# Altium schematic sheet FPGA.SCHDOC: FPGA Connections
size A2; Organization: Altium Limited.; Address1: Level 3, 12a Rodborough Rd; Address2: Frenchs Forest 2086; Address3: NSW; Address4: AUSTRALIA; SheetNumber: 6; SheetTotal: 19; PageSetup: Record=PageOptions|CenterHorizontal=True|CenterVertical=True|PrintScale=0.71|XCorrection=1.00|YCorrection=1.00|PrintKind=0|BorderSize=5000000|LeftOffset=0|BottomOffset=0|Orientation=2|PaperLength=1000|PaperWidth=1000|Scale=100|PaperSource=7|PrintQuality=600|MediaType=1|DitherType=10|PaperKind=A3 (297 x 420mm)|PrintScaleMode=1
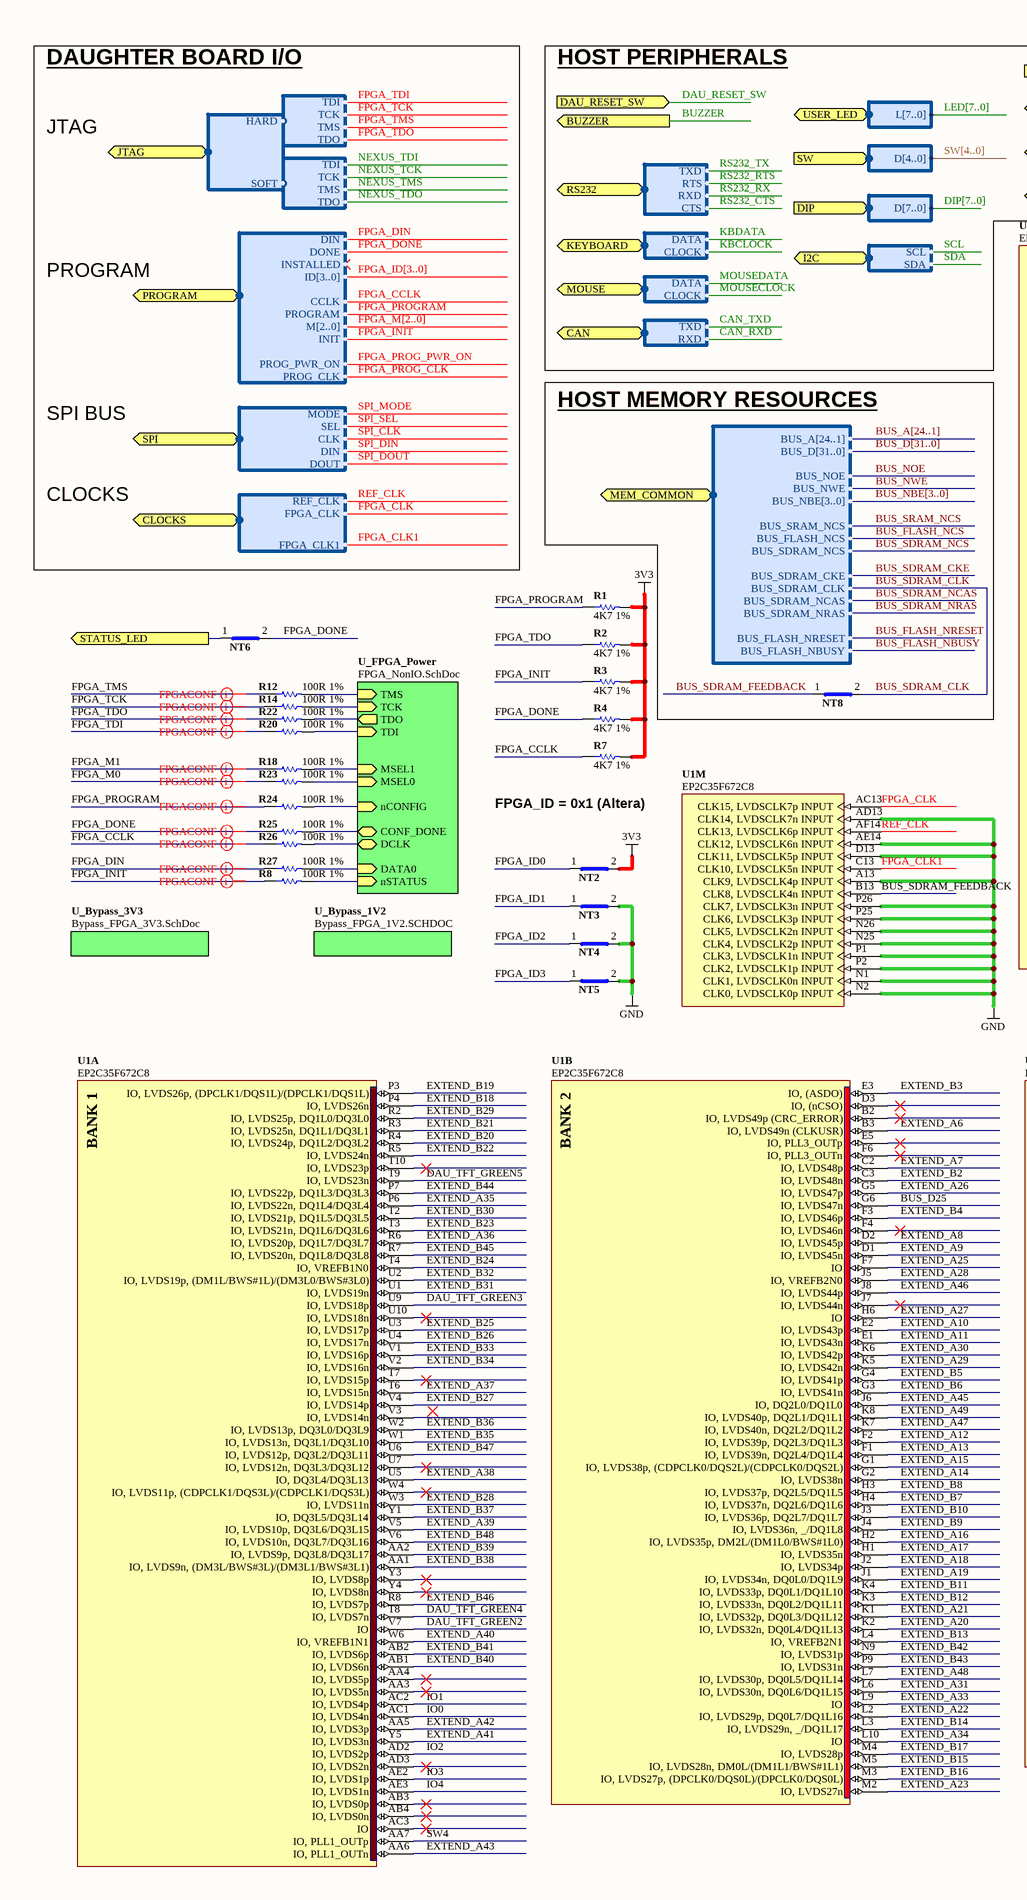
[diagram p0: FPGA.SCHDOC, left]
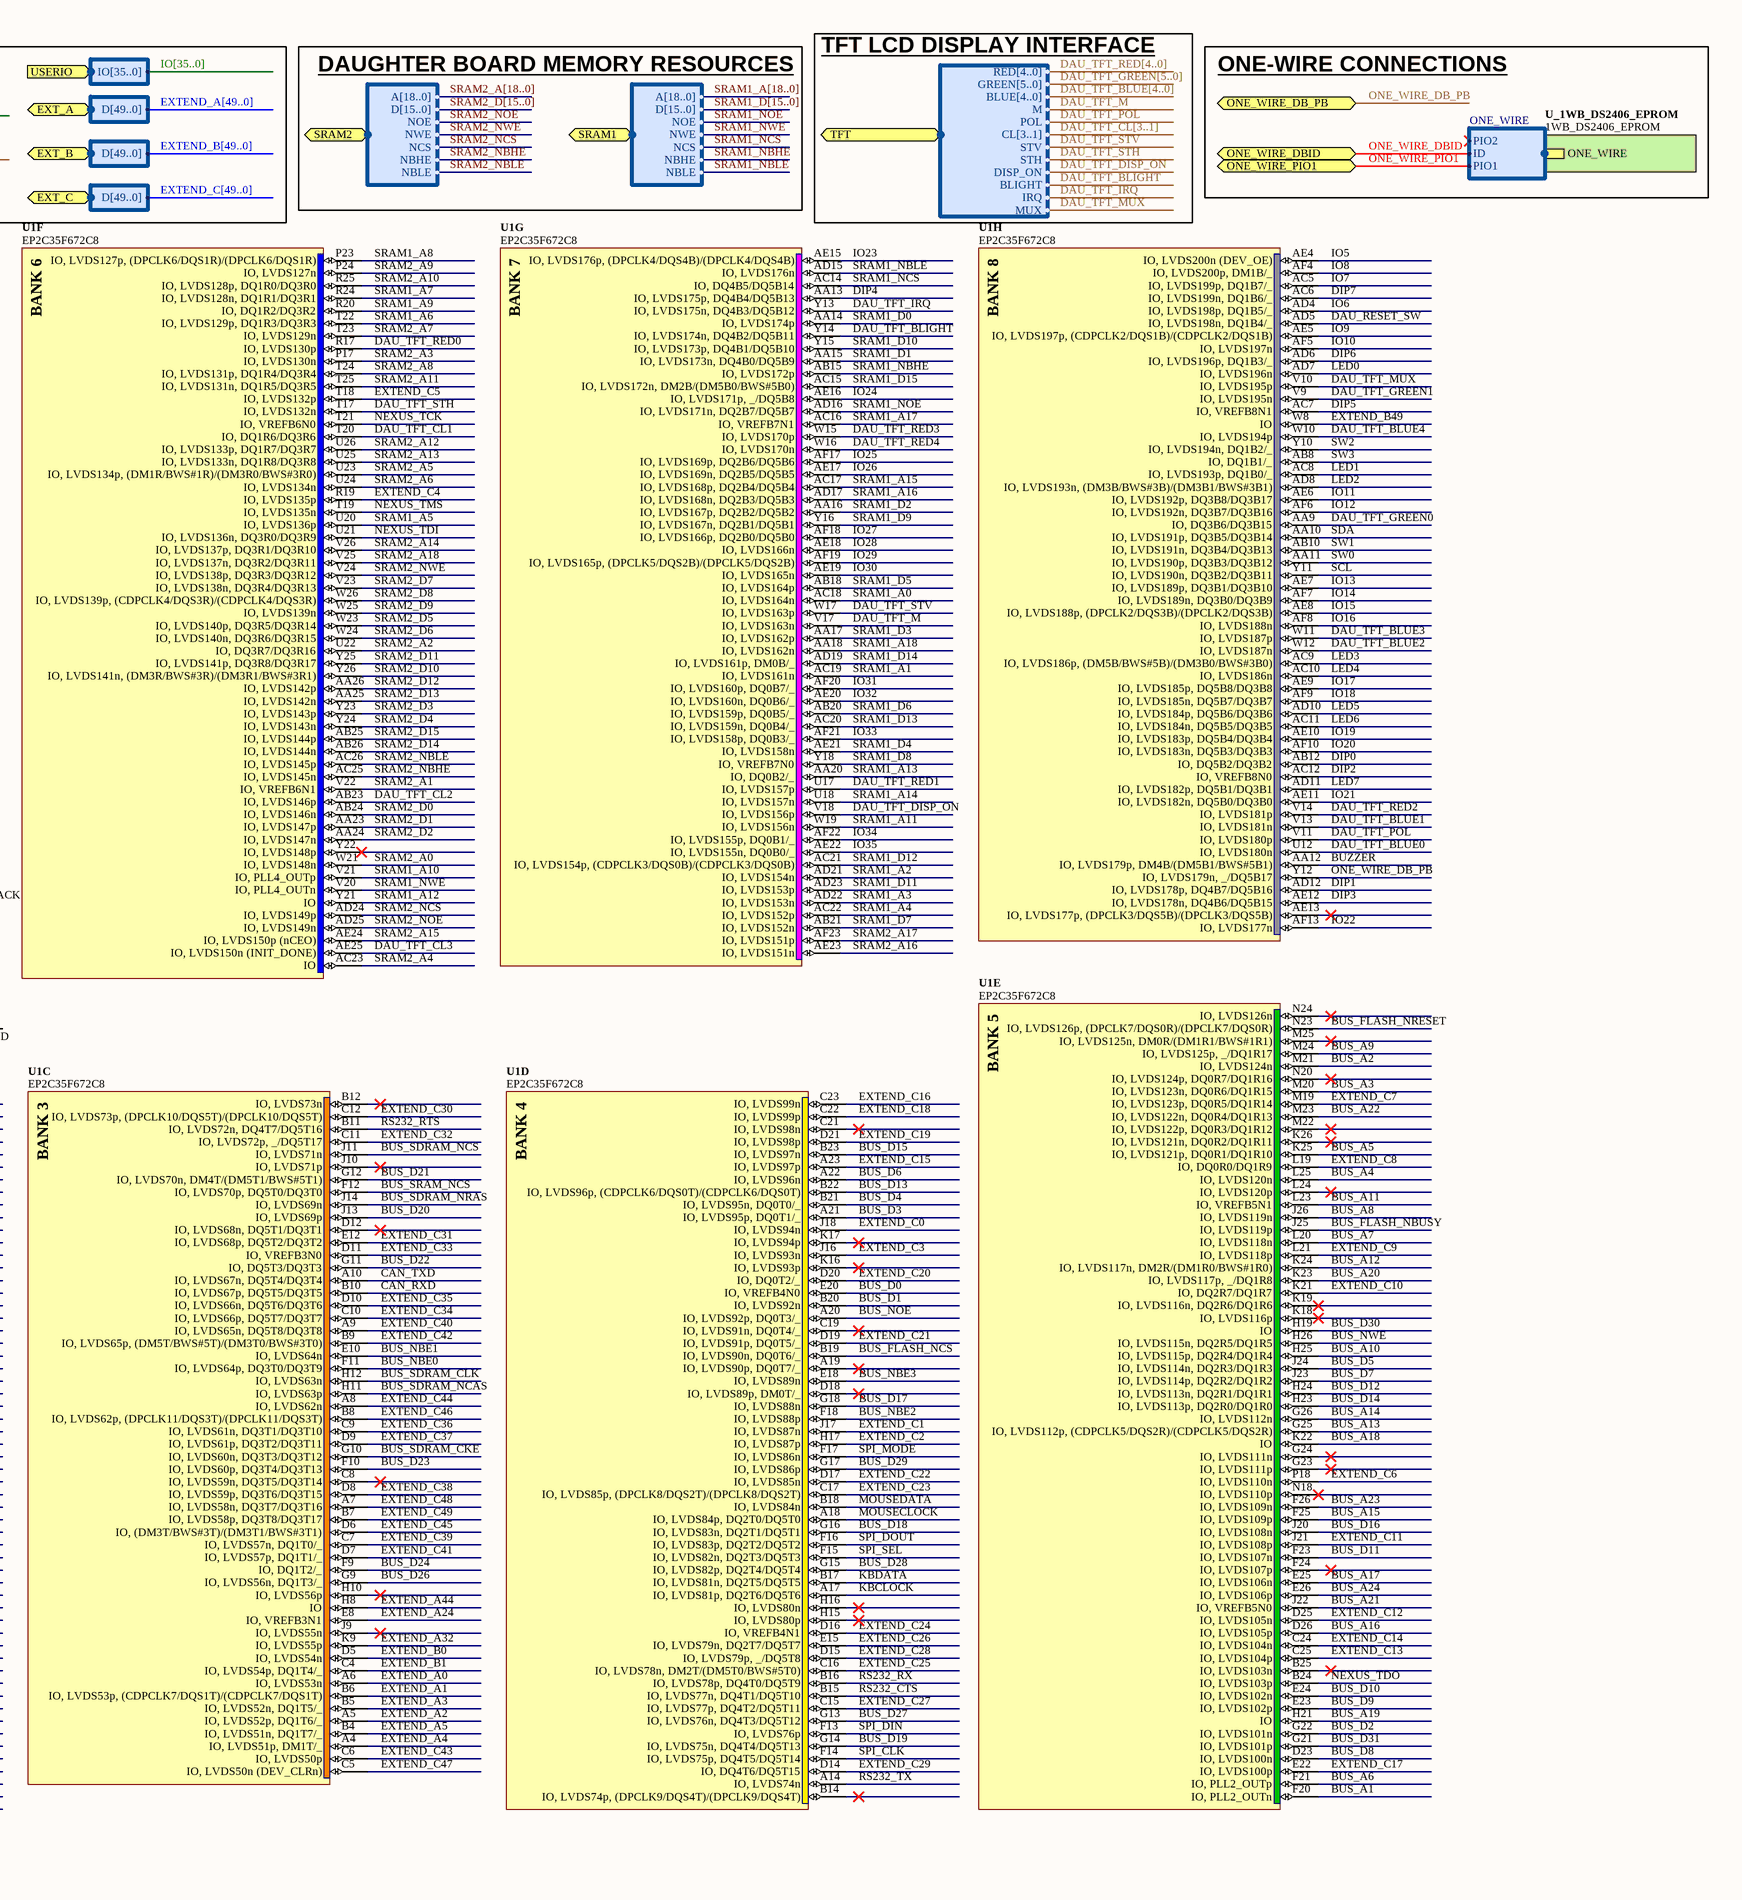
[diagram p1: FPGA.SCHDOC, right]

## Parts
NT2  Net Tie SMT2  [NETTIE-SMT2-8X8]  (value not drawn)  (net tie, no BOM)
NT3  Net Tie SMT2  [NETTIE-SMT2-8X8]  (value not drawn)  (net tie, no BOM)
NT4  Net Tie SMT2  [NETTIE-SMT2-8X8]  (value not drawn)  (net tie, no BOM)
NT5  Net Tie SMT2  [NETTIE-SMT2-8X8]  (value not drawn)  (net tie, no BOM)
NT6  Net Tie SMT2  [NETTIE-SMT2-8X8]  (value not drawn)  (net tie, no BOM)
NT8  Net Tie SMT2  [NETTIE-SMT2-8X8]  (value not drawn)  (net tie, no BOM)
R1  4K7 1%  [RESC1005-STAR]
R2  4K7 1%  [RESC1005-STAR]
R3  4K7 1%  [RESC1005-STAR]
R4  4K7 1%  [RESC1005-STAR]
R7  4K7 1%  [RESC1005-STAR]
R8  100R 1%  [RESC1005-STAR]
R12  100R 1%  [RESC1005-STAR]
R14  100R 1%  [RESC1005-STAR]
R18  100R 1%  [RESC1005-STAR]
R20  100R 1%  [RESC1005-STAR]
R22  100R 1%  [RESC1005-STAR]
R23  100R 1%  [RESC1005-STAR]
R24  100R 1%  [RESC1005-STAR]
R25  100R 1%  [RESC1005-STAR]
R26  100R 1%  [RESC1005-STAR]
R27  100R 1%  [RESC1005-STAR]
U1  EP2C35F672C8  [BGA100P26X26-672]  (parts A,B,C,D,E,F,G,H,M of 14)

## Blocks framed on the sheet
HOST MEMORY RESOURCES: NT8

## Sub-sheets
U_1WB_DS2406_EPROM = 1WB_DS2406_EPROM: ONE_WIRE (harness ONE_WIRE)
U_Bypass_1V2 = Bypass_FPGA_1V2.SCHDOC: no entries
U_Bypass_3V3 = Bypass_FPGA_3V3.SchDoc: no entries
U_FPGA_Power = FPGA_NonIO.SchDoc: TMS (in), CONF_DONE (bidir), MSEL1 (in), DCLK (bidir), MSEL0 (in), DATA0 (in), TCK (in), nSTATUS (in), TDI (in), nCONFIG (in), TDO (out)

## Ports
BUZZER (out), CAN (harness CAN_INT), CLOCKS (harness DAU_CLK), DAU_RESET_SW (in), DIP (harness SW8), EXT_A (harness PBIO), EXT_B (harness PBIO), EXT_C (harness PBIO), I2C (harness I2C), JTAG (harness HARDSOFT_JTAG), KEYBOARD (harness PS2), MEM_COMMON (harness HOSTMEMORY), MOUSE (harness PS2), ONE_WIRE_DB_PB (bidir), ONE_WIRE_DBID (bidir), ONE_WIRE_PIO1 (bidir), PROGRAM (harness DAU_CTRL), RS232 (harness RS232_INT), SPI (harness DAU_SPI), SRAM1 (harness SRAM-256Kx16), SRAM2 (harness SRAM-256Kx16), STATUS_LED (out), SW (harness SW5), TFT (harness DAU_TFT), USER_LED (harness LED8), USERIO (harness IO36)

## Harnesses
ONE_WIRE: ID, PIO1, PIO2
DAU_CLK: REF_CLK, FPGA_CLK, FPGA_CLK1
DAU_SPI: MODE, SEL, CLK, DIN, DOUT
DAU_CTRL: DIN, DONE, INSTALLED, ID[3..0], CCLK, PROGRAM, M[2..0], INIT, PROG_PWR_ON, PROG_CLK
JTAG: TMS, TDO, TDI, TCK
HARDSOFT_JTAG: HARD, SOFT
DAU_TFT: RED[4..0], GREEN[5..0], BLUE[4..0], M, POL, CL[3..1], STV, STH, DISP_ON, BLIGHT, IRQ, MUX
SRAM-256Kx16: A[18..0], D[15..0], NCS, NWE, NOE, NBHE, NBLE
HOSTMEMORY: BUS_A[24..1], BUS_D[31..0], BUS_NOE, BUS_NWE, BUS_NBE[3..0], BUS_SRAM_NCS, BUS_FLASH_NCS, BUS_SDRAM_NCS, BUS_SDRAM_CKE, BUS_SDRAM_CLK, BUS_SDRAM_NCAS, BUS_SDRAM_NRAS, BUS_FLASH_NRESET, BUS_FLASH_NBUSY
LED8: L[7..0]
SW5: D[4..0]
PS2: DATA, CLOCK
RS232_INT: RXD, TXD, RTS, CTS
PBIO: D[49..0]
IO36: IO[35..0]
SW8: D[7..0]
CAN_INT: TXD, RXD
I2C: SCL, SDA

## Nets
3V3: NT2.2(Net2) R1.2 R2.2 R3.2 R4.2 R7.2
GND: NT3.2(Net2) NT4.2(Net2) NT5.2(Net2) U1.A13(CLK9,_LVDSCLK4p_INPUT) U1.AD13(CLK14,_LVDSCLK7n_INPUT) U1.AE14(CLK12,_LVDSCLK6n_INPUT) U1.D13(CLK11,_LVDSCLK5p_INPUT) U1.N1(CLK1,_LVDSCLK0n_INPUT) U1.N2(CLK0,_LVDSCLK0p_INPUT) U1.N25(CLK4,_LVDSCLK2p_INPUT) U1.N26(CLK5,_LVDSCLK2n_INPUT) U1.P1(CLK3,_LVDSCLK1n_INPUT) U1.P2(CLK2,_LVDSCLK1p_INPUT) U1.P25(CLK6,_LVDSCLK3p_INPUT) U1.P26(CLK7,_LVDSCLK3n_INPUT)
BUS_A1: U1.F20(IO,_PLL2_OUTn)
BUS_A2: U1.M21(IO,_LVDS124n)
BUS_A3: U1.M20(IO,_LVDS123n,_DQ0R6/DQ1R15)
BUS_A4: U1.L25(IO,_LVDS120n)
BUS_A5: U1.K25(IO,_LVDS121p,_DQ0R1/DQ1R10)
BUS_A6: U1.F21(IO,_PLL2_OUTp)
BUS_A7: U1.L20(IO,_LVDS118n)
BUS_A8: U1.J26(IO,_LVDS119n)
BUS_A9: U1.M24(IO,_LVDS125p,__/DQ1R17)
BUS_A10: U1.H25(IO,_LVDS115p,_DQ2R4/DQ1R4)
BUS_A11: U1.L23(IO,_VREFB5N1)
BUS_A12: U1.K24(IO,_LVDS117n,_DM2R/(DM1R0/BWS#1R0))
BUS_A13: U1.G25(IO,_LVDS112p,_(CDPCLK5/DQS2R)/(CDPCLK5/DQS2R))
BUS_A14: U1.G26(IO,_LVDS112n)
BUS_A15: U1.F25(IO,_LVDS109p)
BUS_A16: U1.D26(IO,_LVDS105p)
BUS_A17: U1.E25(IO,_LVDS106n)
BUS_A18: U1.K22(IO)
BUS_A19: U1.H21(IO)
BUS_A20: U1.K23(IO,_LVDS117p,__/DQ1R8)
BUS_A21: U1.J22(IO,_VREFB5N0)
BUS_A22: U1.M23(IO,_LVDS122n,_DQ0R4/DQ1R13)
BUS_A23: U1.F26(IO,_LVDS109n)
BUS_A24: U1.E26(IO,_LVDS106p)
BUS_D0: U1.E20(IO,_VREFB4N0)
BUS_D1: U1.B20(IO,_LVDS92n)
BUS_D2: U1.G22(IO,_LVDS101n)
BUS_D3: U1.A21(IO,_LVDS95p,_DQ0T1/_)
BUS_D4: U1.B21(IO,_LVDS95n,_DQ0T0/_)
BUS_D5: U1.J24(IO,_LVDS114n,_DQ2R3/DQ1R3)
BUS_D6: U1.A22(IO,_LVDS96n)
BUS_D7: U1.J23(IO,_LVDS114p,_DQ2R2/DQ1R2)
BUS_D8: U1.D23(IO,_LVDS100n)
BUS_D9: U1.E23(IO,_LVDS102p)
BUS_D10: U1.E24(IO,_LVDS102n)
BUS_D11: U1.F23(IO,_LVDS107n)
BUS_D12: U1.H24(IO,_LVDS113n,_DQ2R1/DQ1R1)
BUS_D13: U1.B22(IO,_LVDS96p,_(CDPCLK6/DQS0T)/(CDPCLK6/DQS0T))
BUS_D14: U1.H23(IO,_LVDS113p,_DQ2R0/DQ1R0)
BUS_D15: U1.B23(IO,_LVDS97n)
BUS_D16: U1.J20(IO,_LVDS108n)
BUS_D17: U1.G18(IO,_LVDS88n)
BUS_D18: U1.G16(IO,_LVDS83n,_DQ2T1/DQ5T1)
BUS_D19: U1.G14(IO,_LVDS75n,_DQ4T4/DQ5T13)
BUS_D20: U1.J13(IO,_LVDS69p)
BUS_D21: U1.G12(IO,_LVDS70n,_DM4T/(DM5T1/BWS#5T1))
BUS_D22: U1.G11(IO,_DQ5T3/DQ3T3)
BUS_D23: U1.F10(IO,_LVDS60p,_DQ3T4/DQ3T13)
BUS_D24: U1.F9(IO,_DQ1T2/_)
BUS_D25: U1.G6(IO,_LVDS47n)
BUS_D26: U1.G9(IO,_LVDS56n,_DQ1T3/_)
BUS_D27: U1.G13(IO,_LVDS76n,_DQ4T3/DQ5T12)
BUS_D28: U1.G15(IO,_LVDS82p,_DQ2T4/DQ5T4)
BUS_D29: U1.G17(IO,_LVDS86p)
BUS_D30: U1.H19(IO)
BUS_D31: U1.G21(IO,_LVDS101p)
BUS_FLASH_NBUSY: U1.J25(IO,_LVDS119p) ; port MEM_COMMON.BUS_FLASH_NBUSY
BUS_FLASH_NCS: U1.B19(IO,_LVDS90n,_DQ0T6/_) ; port MEM_COMMON.BUS_FLASH_NCS
BUS_FLASH_NRESET: U1.N23(IO,_LVDS126p,_(DPCLK7/DQS0R)/(DPCLK7/DQS0R)) ; port MEM_COMMON.BUS_FLASH_NRESET
BUS_NBE0: U1.F11(IO,_LVDS64p,_DQ3T0/DQ3T9)
BUS_NBE1: U1.E10(IO,_LVDS64n)
BUS_NBE2: U1.F18(IO,_LVDS88p)
BUS_NBE3: U1.E18(IO,_LVDS89n)
BUS_NOE: U1.A20(IO,_LVDS92p,_DQ0T3/_) ; port MEM_COMMON.BUS_NOE
BUS_NWE: U1.H26(IO,_LVDS115n,_DQ2R5/DQ1R5) ; port MEM_COMMON.BUS_NWE
BUS_SDRAM_CKE: U1.G10(IO,_LVDS60n,_DQ3T3/DQ3T12) ; port MEM_COMMON.BUS_SDRAM_CKE
BUS_SDRAM_CLK: NT8.2(Net2) U1.H12(IO,_LVDS63n) ; port MEM_COMMON.BUS_SDRAM_CLK
BUS_SDRAM_FEEDBACK: NT8.1(Net1) U1.B13(CLK8,_LVDSCLK4n_INPUT)
BUS_SDRAM_NCAS: U1.H11(IO,_LVDS63p) ; port MEM_COMMON.BUS_SDRAM_NCAS
BUS_SDRAM_NCS: U1.J11(IO,_LVDS71n) ; port MEM_COMMON.BUS_SDRAM_NCS
BUS_SDRAM_NRAS: U1.J14(IO,_LVDS69n) ; port MEM_COMMON.BUS_SDRAM_NRAS
BUS_SRAM_NCS: U1.F12(IO,_LVDS70p,_DQ5T0/DQ3T0) ; port MEM_COMMON.BUS_SRAM_NCS
BUZZER: U1.AA12(IO,_LVDS179p,_DM4B/(DM5B1/BWS#5B1)) ; port BUZZER
CAN_RXD: U1.B10(IO,_LVDS67p,_DQ5T5/DQ3T5) ; port CAN.RXD
CAN_TXD: U1.A10(IO,_LVDS67n,_DQ5T4/DQ3T4) ; port CAN.TXD
DAU_RESET_SW: U1.AD5(IO,_LVDS198n,_DQ1B4/_) ; port DAU_RESET_SW
DAU_TFT_BLIGHT: U1.Y14(IO,_LVDS174n,_DQ4B2/DQ5B11) ; port TFT.BLIGHT
DAU_TFT_BLUE0: U1.U12(IO,_LVDS180n)
DAU_TFT_BLUE1: U1.V13(IO,_LVDS181n)
DAU_TFT_BLUE2: U1.W12(IO,_LVDS187n)
DAU_TFT_BLUE3: U1.W11(IO,_LVDS187p)
DAU_TFT_BLUE4: U1.W10(IO,_LVDS194p)
DAU_TFT_CL1: U1.T20(IO,_DQ1R6/DQ3R6)
DAU_TFT_CL2: U1.AB23(IO,_LVDS146p)
DAU_TFT_CL3: U1.AE25(IO,_LVDS150n_(INIT_DONE))
DAU_TFT_DISP_ON: U1.V18(IO,_LVDS156p) ; port TFT.DISP_ON
DAU_TFT_GREEN0: U1.AA9(IO,_DQ3B6/DQ3B15)
DAU_TFT_GREEN1: U1.V9(IO,_LVDS195n)
DAU_TFT_GREEN2: U1.V7(IO)
DAU_TFT_GREEN3: U1.U9(IO,_LVDS18p)
DAU_TFT_GREEN4: U1.T8(IO,_LVDS7n)
DAU_TFT_GREEN5: U1.T9(IO,_LVDS23n)
DAU_TFT_IRQ: U1.Y13(IO,_LVDS175n,_DQ4B3/DQ5B12) ; port TFT.IRQ
DAU_TFT_M: U1.V17(IO,_LVDS163n) ; port TFT.M
DAU_TFT_MUX: U1.V10(IO,_LVDS195p) ; port TFT.MUX
DAU_TFT_POL: U1.V11(IO,_LVDS180p) ; port TFT.POL
DAU_TFT_RED0: U1.R17(IO,_LVDS130p)
DAU_TFT_RED1: U1.U17(IO,_LVDS157p)
DAU_TFT_RED2: U1.V14(IO,_LVDS181p)
DAU_TFT_RED3: U1.W15(IO,_LVDS170p)
DAU_TFT_RED4: U1.W16(IO,_LVDS170n)
DAU_TFT_STH: U1.T17(IO,_LVDS132n) ; port TFT.STH
DAU_TFT_STV: U1.W17(IO,_LVDS163p) ; port TFT.STV
DIP0: U1.AB12(IO,_DQ5B2/DQ3B2)
DIP1: U1.AD12(IO,_LVDS178p,_DQ4B7/DQ5B16)
DIP2: U1.AC12(IO,_VREFB8N0)
DIP3: U1.AE12(IO,_LVDS178n,_DQ4B6/DQ5B15)
DIP4: U1.AA13(IO,_LVDS175p,_DQ4B4/DQ5B13)
DIP5: U1.AC7(IO,_VREFB8N1)
DIP6: U1.AD6(IO,_LVDS196p,_DQ1B3/_)
DIP7: U1.AC6(IO,_LVDS199n,_DQ1B6/_)
EXTEND_A0: U1.A6(IO,_LVDS53n)
EXTEND_A1: U1.B6(IO,_LVDS53p,_(CDPCLK7/DQS1T)/(CDPCLK7/DQS1T))
EXTEND_A2: U1.A5(IO,_LVDS52p,_DQ1T6/_)
EXTEND_A3: U1.B5(IO,_LVDS52n,_DQ1T5/_)
EXTEND_A4: U1.A4(IO,_LVDS51p,_DM1T/_)
EXTEND_A5: U1.B4(IO,_LVDS51n,_DQ1T7/_)
EXTEND_A6: U1.B3(IO,_LVDS49n_(CLKUSR))
EXTEND_A7: U1.C2(IO,_LVDS48p)
EXTEND_A8: U1.D2(IO,_LVDS45p)
EXTEND_A9: U1.D1(IO,_LVDS45n)
EXTEND_A10: U1.E2(IO,_LVDS43p)
EXTEND_A11: U1.E1(IO,_LVDS43n)
EXTEND_A12: U1.F2(IO,_LVDS39p,_DQ2L3/DQ1L3)
EXTEND_A13: U1.F1(IO,_LVDS39n,_DQ2L4/DQ1L4)
EXTEND_A14: U1.G2(IO,_LVDS38n)
EXTEND_A15: U1.G1(IO,_LVDS38p,_(CDPCLK0/DQS2L)/(CDPCLK0/DQS2L))
EXTEND_A16: U1.H2(IO,_LVDS35p,_DM2L/(DM1L0/BWS#1L0))
EXTEND_A17: U1.H1(IO,_LVDS35n)
EXTEND_A18: U1.J2(IO,_LVDS34p)
EXTEND_A19: U1.J1(IO,_LVDS34n,_DQ0L0/DQ1L9)
EXTEND_A20: U1.K2(IO,_LVDS32n,_DQ0L4/DQ1L13)
EXTEND_A21: U1.K1(IO,_LVDS32p,_DQ0L3/DQ1L12)
EXTEND_A22: U1.L2(IO,_LVDS29p,_DQ0L7/DQ1L16)
EXTEND_A23: U1.M2(IO,_LVDS27n)
EXTEND_A24: U1.E8(IO,_VREFB3N1)
EXTEND_A25: U1.F7(IO)
EXTEND_A26: U1.G5(IO,_LVDS47p)
EXTEND_A27: U1.H6(IO)
EXTEND_A28: U1.J5(IO,_VREFB2N0)
EXTEND_A29: U1.K5(IO,_LVDS42n)
EXTEND_A30: U1.K6(IO,_LVDS42p)
EXTEND_A31: U1.L6(IO,_LVDS30n,_DQ0L6/DQ1L15)
EXTEND_A32: U1.K9(IO,_LVDS55p)
EXTEND_A33: U1.L9(IO)
EXTEND_A34: U1.L10(IO)
EXTEND_A35: U1.P6(IO,_LVDS22n,_DQ1L4/DQ3L4)
EXTEND_A36: U1.R6(IO,_LVDS20p,_DQ1L7/DQ3L7)
EXTEND_A37: U1.T6(IO,_LVDS15n)
EXTEND_A38: U1.U5(IO,_DQ3L4/DQ3L13)
EXTEND_A39: U1.V5(IO,_LVDS10p,_DQ3L6/DQ3L15)
EXTEND_A40: U1.W6(IO,_VREFB1N1)
EXTEND_A41: U1.Y5(IO,_LVDS3n)
EXTEND_A42: U1.AA5(IO,_LVDS3p)
EXTEND_A43: U1.AA6(IO,_PLL1_OUTn)
EXTEND_A44: U1.H8(IO)
EXTEND_A45: U1.J6(IO,_DQ2L0/DQ1L0)
EXTEND_A46: U1.J8(IO,_LVDS44p)
EXTEND_A47: U1.K7(IO,_LVDS40n,_DQ2L2/DQ1L2)
EXTEND_A48: U1.L7(IO,_LVDS30p,_DQ0L5/DQ1L14)
EXTEND_A49: U1.K8(IO,_LVDS40p,_DQ2L1/DQ1L1)
EXTEND_B0: U1.D5(IO,_LVDS54n)
EXTEND_B1: U1.C4(IO,_LVDS54p,_DQ1T4/_)
EXTEND_B2: U1.C3(IO,_LVDS48n)
EXTEND_B3: U1.E3(IO,_(ASDO))
EXTEND_B4: U1.F3(IO,_LVDS46p)
EXTEND_B5: U1.G4(IO,_LVDS41p)
EXTEND_B6: U1.G3(IO,_LVDS41n)
EXTEND_B7: U1.H4(IO,_LVDS37n,_DQ2L6/DQ1L6)
EXTEND_B8: U1.H3(IO,_LVDS37p,_DQ2L5/DQ1L5)
EXTEND_B9: U1.J4(IO,_LVDS36n,__/DQ1L8)
EXTEND_B10: U1.J3(IO,_LVDS36p,_DQ2L7/DQ1L7)
EXTEND_B11: U1.K4(IO,_LVDS33p,_DQ0L1/DQ1L10)
EXTEND_B12: U1.K3(IO,_LVDS33n,_DQ0L2/DQ1L11)
EXTEND_B13: U1.L4(IO,_VREFB2N1)
EXTEND_B14: U1.L3(IO,_LVDS29n,__/DQ1L17)
EXTEND_B15: U1.M5(IO,_LVDS28n,_DM0L/(DM1L1/BWS#1L1))
EXTEND_B16: U1.M3(IO,_LVDS27p,_(DPCLK0/DQS0L)/(DPCLK0/DQS0L))
EXTEND_B17: U1.M4(IO,_LVDS28p)
EXTEND_B18: U1.P4(IO,_LVDS26n)
EXTEND_B19: U1.P3(IO,_LVDS26p,_(DPCLK1/DQS1L)/(DPCLK1/DQS1L))
EXTEND_B20: U1.R4(IO,_LVDS24p,_DQ1L2/DQ3L2)
EXTEND_B21: U1.R3(IO,_LVDS25n,_DQ1L1/DQ3L1)
EXTEND_B22: U1.R5(IO,_LVDS24n)
EXTEND_B23: U1.T3(IO,_LVDS21n,_DQ1L6/DQ3L6)
EXTEND_B24: U1.T4(IO,_VREFB1N0)
EXTEND_B25: U1.U3(IO,_LVDS17p)
EXTEND_B26: U1.U4(IO,_LVDS17n)
EXTEND_B27: U1.V4(IO,_LVDS14p)
EXTEND_B28: U1.W3(IO,_LVDS11n)
EXTEND_B29: U1.R2(IO,_LVDS25p,_DQ1L0/DQ3L0)
EXTEND_B30: U1.T2(IO,_LVDS21p,_DQ1L5/DQ3L5)
EXTEND_B31: U1.U1(IO,_LVDS19n)
EXTEND_B32: U1.U2(IO,_LVDS19p,_(DM1L/BWS#1L)/(DM3L0/BWS#3L0))
EXTEND_B33: U1.V1(IO,_LVDS16p)
EXTEND_B34: U1.V2(IO,_LVDS16n)
EXTEND_B35: U1.W1(IO,_LVDS13n,_DQ3L1/DQ3L10)
EXTEND_B36: U1.W2(IO,_LVDS13p,_DQ3L0/DQ3L9)
EXTEND_B37: U1.Y1(IO,_DQ3L5/DQ3L14)
EXTEND_B38: U1.AA1(IO,_LVDS9n,_(DM3L/BWS#3L)/(DM3L1/BWS#3L1))
EXTEND_B39: U1.AA2(IO,_LVDS9p,_DQ3L8/DQ3L17)
EXTEND_B40: U1.AB1(IO,_LVDS6n)
EXTEND_B41: U1.AB2(IO,_LVDS6p)
EXTEND_B42: U1.N9(IO,_LVDS31p)
EXTEND_B43: U1.P9(IO,_LVDS31n)
EXTEND_B44: U1.P7(IO,_LVDS22p,_DQ1L3/DQ3L3)
EXTEND_B45: U1.R7(IO,_LVDS20n,_DQ1L8/DQ3L8)
EXTEND_B46: U1.R8(IO,_LVDS7p)
EXTEND_B47: U1.U6(IO,_LVDS12p,_DQ3L2/DQ3L11)
EXTEND_B48: U1.V6(IO,_LVDS10n,_DQ3L7/DQ3L16)
EXTEND_B49: U1.W8(IO)
EXTEND_C0: U1.J18(IO,_LVDS94n)
EXTEND_C1: U1.J17(IO,_LVDS87n)
EXTEND_C2: U1.H17(IO,_LVDS87p)
EXTEND_C3: U1.J16(IO,_LVDS93n)
EXTEND_C4: U1.R19(IO,_LVDS135p)
EXTEND_C5: U1.T18(IO,_LVDS132p)
EXTEND_C6: U1.P18(IO,_LVDS110n)
EXTEND_C7: U1.M19(IO,_LVDS123p,_DQ0R5/DQ1R14)
EXTEND_C8: U1.L19(IO,_DQ0R0/DQ1R9)
EXTEND_C9: U1.L21(IO,_LVDS118p)
EXTEND_C10: U1.K21(IO,_DQ2R7/DQ1R7)
EXTEND_C11: U1.J21(IO,_LVDS108p)
EXTEND_C12: U1.D25(IO,_LVDS105n)
EXTEND_C13: U1.C25(IO,_LVDS104p)
EXTEND_C14: U1.C24(IO,_LVDS104n)
EXTEND_C15: U1.A23(IO,_LVDS97p)
EXTEND_C16: U1.C23(IO,_LVDS99n)
EXTEND_C17: U1.E22(IO,_LVDS100p)
EXTEND_C18: U1.C22(IO,_LVDS99p)
EXTEND_C19: U1.D21(IO,_LVDS98p)
EXTEND_C20: U1.D20(IO,_DQ0T2/_)
EXTEND_C21: U1.D19(IO,_LVDS91p,_DQ0T5/_)
EXTEND_C22: U1.D17(IO,_LVDS85n)
EXTEND_C23: U1.C17(IO,_LVDS85p,_(DPCLK8/DQS2T)/(DPCLK8/DQS2T))
EXTEND_C24: U1.D16(IO,_VREFB4N1)
EXTEND_C25: U1.C16(IO,_LVDS78n,_DM2T/(DM5T0/BWS#5T0))
EXTEND_C26: U1.E15(IO,_LVDS79n,_DQ2T7/DQ5T7)
EXTEND_C27: U1.C15(IO,_LVDS77p,_DQ4T2/DQ5T11)
EXTEND_C28: U1.D15(IO,_LVDS79p,__/DQ5T8)
EXTEND_C29: U1.D14(IO,_DQ4T6/DQ5T15)
EXTEND_C30: U1.C12(IO,_LVDS73p,_(DPCLK10/DQS5T)/(DPCLK10/DQS5T))
EXTEND_C31: U1.E12(IO,_LVDS68p,_DQ5T2/DQ3T2)
EXTEND_C32: U1.C11(IO,_LVDS72p,__/DQ5T17)
EXTEND_C33: U1.D11(IO,_VREFB3N0)
EXTEND_C34: U1.C10(IO,_LVDS66p,_DQ5T7/DQ3T7)
EXTEND_C35: U1.D10(IO,_LVDS66n,_DQ5T6/DQ3T6)
EXTEND_C36: U1.C9(IO,_LVDS61n,_DQ3T1/DQ3T10)
EXTEND_C37: U1.D9(IO,_LVDS61p,_DQ3T2/DQ3T11)
EXTEND_C38: U1.D8(IO,_LVDS59p,_DQ3T6/DQ3T15)
EXTEND_C39: U1.C7(IO,_LVDS57n,_DQ1T0/_)
EXTEND_C40: U1.A9(IO,_LVDS65n,_DQ5T8/DQ3T8)
EXTEND_C41: U1.D7(IO,_LVDS57p,_DQ1T1/_)
EXTEND_C42: U1.B9(IO,_LVDS65p,_(DM5T/BWS#5T)/(DM3T0/BWS#3T0))
EXTEND_C43: U1.C6(IO,_LVDS50p)
EXTEND_C44: U1.A8(IO,_LVDS62n)
EXTEND_C45: U1.D6(IO,_(DM3T/BWS#3T)/(DM3T1/BWS#3T1))
EXTEND_C46: U1.B8(IO,_LVDS62p,_(DPCLK11/DQS3T)/(DPCLK11/DQS3T))
EXTEND_C47: U1.C5(IO,_LVDS50n_(DEV_CLRn))
EXTEND_C48: U1.A7(IO,_LVDS58n,_DQ3T7/DQ3T16)
EXTEND_C49: U1.B7(IO,_LVDS58p,_DQ3T8/DQ3T17)
FPGA_CCLK: R7.1 R26.1 ; port PROGRAM.CCLK
FPGA_CLK: U1.AC13(CLK15,_LVDSCLK7p_INPUT) ; port CLOCKS.FPGA_CLK
FPGA_CLK1: U1.C13(CLK10,_LVDSCLK5n_INPUT) ; port CLOCKS.FPGA_CLK1
FPGA_DIN: R27.1 ; port PROGRAM.DIN
FPGA_DONE: NT6.2(Net2) R4.1 R25.1 ; port PROGRAM.DONE
FPGA_ID0: NT2.1(Net1)
FPGA_ID1: NT3.1(Net1)
FPGA_ID2: NT4.1(Net1)
FPGA_ID3: NT5.1(Net1)
FPGA_INIT: R3.1 R8.1 ; port PROGRAM.INIT
FPGA_M0: R23.1
FPGA_M1: R18.1
FPGA_PROG_CLK: port PROGRAM.PROG_CLK
FPGA_PROG_PWR_ON: port PROGRAM.PROG_PWR_ON
FPGA_PROGRAM: R1.1 R24.1 ; port PROGRAM.PROGRAM
FPGA_TCK: R14.1 ; harness JTAG.TCK
FPGA_TDI: R20.1 ; harness JTAG.TDI
FPGA_TDO: R2.1 R22.1 ; harness JTAG.TDO
FPGA_TMS: R12.1 ; harness JTAG.TMS
IO0: U1.AC1(IO,_LVDS4n)
IO1: U1.AC2(IO,_LVDS4p)
IO2: U1.AD2(IO,_LVDS2p)
IO3: U1.AE2(IO,_LVDS1p)
IO4: U1.AE3(IO,_LVDS1n)
IO5: U1.AE4(IO,_LVDS200n_(DEV_OE))
IO6: U1.AD4(IO,_LVDS198p,_DQ1B5/_)
IO7: U1.AC5(IO,_LVDS199p,_DQ1B7/_)
IO8: U1.AF4(IO,_LVDS200p,_DM1B/_)
IO9: U1.AE5(IO,_LVDS197p,_(CDPCLK2/DQS1B)/(CDPCLK2/DQS1B))
IO10: U1.AF5(IO,_LVDS197n)
IO11: U1.AE6(IO,_LVDS192p,_DQ3B8/DQ3B17)
IO12: U1.AF6(IO,_LVDS192n,_DQ3B7/DQ3B16)
IO13: U1.AE7(IO,_LVDS189p,_DQ3B1/DQ3B10)
IO14: U1.AF7(IO,_LVDS189n,_DQ3B0/DQ3B9)
IO15: U1.AE8(IO,_LVDS188p,_(DPCLK2/DQS3B)/(DPCLK2/DQS3B))
IO16: U1.AF8(IO,_LVDS188n)
IO17: U1.AE9(IO,_LVDS185p,_DQ5B8/DQ3B8)
IO18: U1.AF9(IO,_LVDS185n,_DQ5B7/DQ3B7)
IO19: U1.AE10(IO,_LVDS183p,_DQ5B4/DQ3B4)
IO20: U1.AF10(IO,_LVDS183n,_DQ5B3/DQ3B3)
IO21: U1.AE11(IO,_LVDS182n,_DQ5B0/DQ3B0)
IO22: U1.AF13(IO,_LVDS177n)
IO23: U1.AE15(IO,_LVDS176p,_(DPCLK4/DQS4B)/(DPCLK4/DQS4B))
IO24: U1.AE16(IO,_LVDS171p,__/DQ5B8)
IO25: U1.AF17(IO,_LVDS169p,_DQ2B6/DQ5B6)
IO26: U1.AE17(IO,_LVDS169n,_DQ2B5/DQ5B5)
IO27: U1.AF18(IO,_LVDS166p,_DQ2B0/DQ5B0)
IO28: U1.AE18(IO,_LVDS166n)
IO29: U1.AF19(IO,_LVDS165p,_(DPCLK5/DQS2B)/(DPCLK5/DQS2B))
IO30: U1.AE19(IO,_LVDS165n)
IO31: U1.AF20(IO,_LVDS160p,_DQ0B7/_)
IO32: U1.AE20(IO,_LVDS160n,_DQ0B6/_)
IO33: U1.AF21(IO,_LVDS158p,_DQ0B3/_)
IO34: U1.AF22(IO,_LVDS155p,_DQ0B1/_)
IO35: U1.AE22(IO,_LVDS155n,_DQ0B0/_)
KBCLOCK: U1.A17(IO,_LVDS81p,_DQ2T6/DQ5T6) ; port KEYBOARD.CLOCK
KBDATA: U1.B17(IO,_LVDS81n,_DQ2T5/DQ5T5) ; port KEYBOARD.DATA
LED0: U1.AD7(IO,_LVDS196n)
LED1: U1.AC8(IO,_LVDS193p,_DQ1B0/_)
LED2: U1.AD8(IO,_LVDS193n,_(DM3B/BWS#3B)/(DM3B1/BWS#3B1))
LED3: U1.AC9(IO,_LVDS186p,_(DM5B/BWS#5B)/(DM3B0/BWS#3B0))
LED4: U1.AC10(IO,_LVDS186n)
LED5: U1.AD10(IO,_LVDS184p,_DQ5B6/DQ3B6)
LED6: U1.AC11(IO,_LVDS184n,_DQ5B5/DQ3B5)
LED7: U1.AD11(IO,_LVDS182p,_DQ5B1/DQ3B1)
MOUSECLOCK: U1.A18(IO,_LVDS84p,_DQ2T0/DQ5T0) ; port MOUSE.CLOCK
MOUSEDATA: U1.B18(IO,_LVDS84n) ; port MOUSE.DATA
NEXUS_TCK: U1.T21(IO,_VREFB6N0) ; harness JTAG.TCK
NEXUS_TDI: U1.U21(IO,_LVDS136n,_DQ3R0/DQ3R9) ; harness JTAG.TDI
NEXUS_TDO: U1.B24(IO,_LVDS103p) ; harness JTAG.TDO
NEXUS_TMS: U1.T19(IO,_LVDS135n) ; harness JTAG.TMS
ONE_WIRE_DB_PB: U1.Y12(IO,_LVDS179n,__/DQ5B17) ; port ONE_WIRE_DB_PB
ONE_WIRE_DBID: port ONE_WIRE_DBID, sheet U_1WB_DS2406_EPROM/ONE_WIRE.ID
ONE_WIRE_PIO1: port ONE_WIRE_PIO1, sheet U_1WB_DS2406_EPROM/ONE_WIRE.PIO1
REF_CLK: U1.AF14(CLK13,_LVDSCLK6p_INPUT) ; port CLOCKS.REF_CLK
RS232_CTS: U1.B15(IO,_LVDS77n,_DQ4T1/DQ5T10) ; port RS232.CTS
RS232_RTS: U1.B11(IO,_LVDS72n,_DQ4T7/DQ5T16) ; port RS232.RTS
RS232_RX: U1.B16(IO,_LVDS78p,_DQ4T0/DQ5T9) ; port RS232.RXD
RS232_TX: U1.A14(IO,_LVDS74n) ; port RS232.TXD
SCL: U1.Y11(IO,_LVDS190n,_DQ3B2/DQ3B11) ; port I2C.SCL
SDA: U1.AA10(IO,_LVDS191p,_DQ3B5/DQ3B14) ; port I2C.SDA
SPI_CLK: U1.F14(IO,_LVDS75p,_DQ4T5/DQ5T14) ; port SPI.CLK
SPI_DIN: U1.F13(IO,_LVDS76p) ; port SPI.DIN
SPI_DOUT: U1.F16(IO,_LVDS83p,_DQ2T2/DQ5T2) ; port SPI.DOUT
SPI_MODE: U1.F17(IO,_LVDS86n) ; port SPI.MODE
SPI_SEL: U1.F15(IO,_LVDS82n,_DQ2T3/DQ5T3) ; port SPI.SEL
SRAM1_A0: U1.AC18(IO,_LVDS164n)
SRAM1_A1: U1.AC19(IO,_LVDS161n)
SRAM1_A2: U1.AD21(IO,_LVDS154n)
SRAM1_A3: U1.AD22(IO,_LVDS153n)
SRAM1_A4: U1.AC22(IO,_LVDS152p)
SRAM1_A5: U1.U20(IO,_LVDS136p)
SRAM1_A6: U1.T22(IO,_LVDS129p,_DQ1R3/DQ3R3)
SRAM1_A7: U1.R24(IO,_LVDS128n,_DQ1R1/DQ3R1)
SRAM1_A8: U1.P23(IO,_LVDS127p,_(DPCLK6/DQS1R)/(DPCLK6/DQS1R))
SRAM1_A9: U1.R20(IO,_DQ1R2/DQ3R2)
SRAM1_A10: U1.V21(IO,_PLL4_OUTp)
SRAM1_A11: U1.W19(IO,_LVDS156n)
SRAM1_A12: U1.Y21(IO)
SRAM1_A13: U1.AA20(IO,_DQ0B2/_)
SRAM1_A14: U1.U18(IO,_LVDS157n)
SRAM1_A15: U1.AC17(IO,_LVDS168p,_DQ2B4/DQ5B4)
SRAM1_A16: U1.AD17(IO,_LVDS168n,_DQ2B3/DQ5B3)
SRAM1_A17: U1.AC16(IO,_VREFB7N1)
SRAM1_A18: U1.AA18(IO,_LVDS162n)
SRAM1_D0: U1.AA14(IO,_LVDS174p)
SRAM1_D1: U1.AA15(IO,_LVDS173n,_DQ4B0/DQ5B9)
SRAM1_D2: U1.AA16(IO,_LVDS167p,_DQ2B2/DQ5B2)
SRAM1_D3: U1.AA17(IO,_LVDS162p)
SRAM1_D4: U1.AE21(IO,_LVDS158n)
SRAM1_D5: U1.AB18(IO,_LVDS164p)
SRAM1_D6: U1.AB20(IO,_LVDS159p,_DQ0B5/_)
SRAM1_D7: U1.AB21(IO,_LVDS152n)
SRAM1_D8: U1.Y18(IO,_VREFB7N0)
SRAM1_D9: U1.Y16(IO,_LVDS167n,_DQ2B1/DQ5B1)
SRAM1_D10: U1.Y15(IO,_LVDS173p,_DQ4B1/DQ5B10)
SRAM1_D11: U1.AD23(IO,_LVDS153p)
SRAM1_D12: U1.AC21(IO,_LVDS154p,_(CDPCLK3/DQS0B)/(CDPCLK3/DQS0B))
SRAM1_D13: U1.AC20(IO,_LVDS159n,_DQ0B4/_)
SRAM1_D14: U1.AD19(IO,_LVDS161p,_DM0B/_)
SRAM1_D15: U1.AC15(IO,_LVDS172n,_DM2B/(DM5B0/BWS#5B0))
SRAM1_NBHE: U1.AB15(IO,_LVDS172p) ; port SRAM1.NBHE
SRAM1_NBLE: U1.AD15(IO,_LVDS176n) ; port SRAM1.NBLE
SRAM1_NCS: U1.AC14(IO,_DQ4B5/DQ5B14) ; port SRAM1.NCS
SRAM1_NOE: U1.AD16(IO,_LVDS171n,_DQ2B7/DQ5B7) ; port SRAM1.NOE
SRAM1_NWE: U1.V20(IO,_PLL4_OUTn) ; port SRAM1.NWE
SRAM2_A0: U1.W21(IO,_LVDS148n)
SRAM2_A1: U1.V22(IO,_VREFB6N1)
SRAM2_A2: U1.U22(IO,_DQ3R7/DQ3R16)
SRAM2_A3: U1.P17(IO,_LVDS130n)
SRAM2_A4: U1.AC23(IO)
SRAM2_A5: U1.U23(IO,_LVDS134p,_(DM1R/BWS#1R)/(DM3R0/BWS#3R0))
SRAM2_A6: U1.U24(IO,_LVDS134n)
SRAM2_A7: U1.T23(IO,_LVDS129n)
SRAM2_A8: U1.T24(IO,_LVDS131p,_DQ1R4/DQ3R4)
SRAM2_A9: U1.P24(IO,_LVDS127n)
SRAM2_A10: U1.R25(IO,_LVDS128p,_DQ1R0/DQ3R0)
SRAM2_A11: U1.T25(IO,_LVDS131n,_DQ1R5/DQ3R5)
SRAM2_A12: U1.U26(IO,_LVDS133p,_DQ1R7/DQ3R7)
SRAM2_A13: U1.U25(IO,_LVDS133n,_DQ1R8/DQ3R8)
SRAM2_A14: U1.V26(IO,_LVDS137p,_DQ3R1/DQ3R10)
SRAM2_A15: U1.AE24(IO,_LVDS150p_(nCEO))
SRAM2_A16: U1.AE23(IO,_LVDS151n)
SRAM2_A17: U1.AF23(IO,_LVDS151p)
SRAM2_A18: U1.V25(IO,_LVDS137n,_DQ3R2/DQ3R11)
SRAM2_D0: U1.AB24(IO,_LVDS146n)
SRAM2_D1: U1.AA23(IO,_LVDS147p)
SRAM2_D2: U1.AA24(IO,_LVDS147n)
SRAM2_D3: U1.Y23(IO,_LVDS143p)
SRAM2_D4: U1.Y24(IO,_LVDS143n)
SRAM2_D5: U1.W23(IO,_LVDS140p,_DQ3R5/DQ3R14)
SRAM2_D6: U1.W24(IO,_LVDS140n,_DQ3R6/DQ3R15)
SRAM2_D7: U1.V23(IO,_LVDS138n,_DQ3R4/DQ3R13)
SRAM2_D8: U1.W26(IO,_LVDS139p,_(CDPCLK4/DQS3R)/(CDPCLK4/DQS3R))
SRAM2_D9: U1.W25(IO,_LVDS139n)
SRAM2_D10: U1.Y26(IO,_LVDS141n,_(DM3R/BWS#3R)/(DM3R1/BWS#3R1))
SRAM2_D11: U1.Y25(IO,_LVDS141p,_DQ3R8/DQ3R17)
SRAM2_D12: U1.AA26(IO,_LVDS142p)
SRAM2_D13: U1.AA25(IO,_LVDS142n)
SRAM2_D14: U1.AB26(IO,_LVDS144n)
SRAM2_D15: U1.AB25(IO,_LVDS144p)
SRAM2_NBHE: U1.AC25(IO,_LVDS145n) ; port SRAM2.NBHE
SRAM2_NBLE: U1.AC26(IO,_LVDS145p) ; port SRAM2.NBLE
SRAM2_NCS: U1.AD24(IO,_LVDS149p) ; port SRAM2.NCS
SRAM2_NOE: U1.AD25(IO,_LVDS149n) ; port SRAM2.NOE
SRAM2_NWE: U1.V24(IO,_LVDS138p,_DQ3R3/DQ3R12) ; port SRAM2.NWE
STATUS_LED: NT6.1(Net1) ; port STATUS_LED
SW0: U1.AA11(IO,_LVDS190p,_DQ3B3/DQ3B12)
SW1: U1.AB10(IO,_LVDS191n,_DQ3B4/DQ3B13)
SW2: U1.Y10(IO,_LVDS194n,_DQ1B2/_)
SW3: U1.AB8(IO,_DQ1B1/_)
SW4: U1.AA7(IO,_PLL1_OUTp)
NetR8_2: R8.2 ; sheet U_FPGA_Power/nSTATUS
NetR12_2: R12.2 ; sheet U_FPGA_Power/TMS
NetR14_2: R14.2 ; sheet U_FPGA_Power/TCK
NetR18_2: R18.2 ; sheet U_FPGA_Power/MSEL1
NetR20_2: R20.2 ; sheet U_FPGA_Power/TDI
NetR22_2: R22.2 ; sheet U_FPGA_Power/TDO
NetR23_2: R23.2 ; sheet U_FPGA_Power/MSEL0
NetR24_2: R24.2 ; sheet U_FPGA_Power/nCONFIG
NetR25_2: R25.2 ; sheet U_FPGA_Power/CONF_DONE
NetR26_2: R26.2 ; sheet U_FPGA_Power/DCLK
NetR27_2: R27.2 ; sheet U_FPGA_Power/DATA0

Not connected (* = marked no-connect by the designer): U1 A19(IO,_LVDS90p,_DQ0T7/_)* AA3(IO,_LVDS5n)* AA4(IO,_LVDS5p)* AB3(IO,_LVDS0p)* AB4(IO,_LVDS0n)* AC3(IO)* AD3(IO,_LVDS2n)* AE13(IO,_LVDS177p,_(DPCLK3/DQS5B)/(DPCLK3/DQS5B))* B2(IO,_LVDS49p_(CRC_ERROR))* B12(IO,_LVDS73n)* B14(IO,_LVDS74p,_(DPCLK9/DQS4T)/(DPCLK9/DQS4T))* B25(IO,_LVDS103n)* C8(IO,_LVDS59n,_DQ3T5/DQ3T14)* C19(IO,_LVDS91n,_DQ0T4/_)* C21(IO,_LVDS98n)* D3(IO,_(nCSO))* D12(IO,_LVDS68n,_DQ5T1/DQ3T1)* D18(IO,_LVDS89p,_DM0T/_)* E5(IO,_PLL3_OUTp)* F4(IO,_LVDS46n)* F6(IO,_PLL3_OUTn)* F24(IO,_LVDS107p)* G23(IO,_LVDS111p)* G24(IO,_LVDS111n)* H10(IO,_LVDS56p)* H15(IO,_LVDS80p)* H16(IO,_LVDS80n)* J7(IO,_LVDS44n)* J9(IO,_LVDS55n)* J10(IO,_LVDS71p)* K16(IO,_LVDS93p)* K17(IO,_LVDS94p)* K18(IO,_LVDS116p)* K19(IO,_LVDS116n,_DQ2R6/DQ1R6)* K26(IO,_LVDS121n,_DQ0R2/DQ1R11)* L24(IO,_LVDS120p)* M22(IO,_LVDS122p,_DQ0R3/DQ1R12)* M25(IO,_LVDS125n,_DM0R/(DM1R1/BWS#1R1))* N18(IO,_LVDS110p)* N20(IO,_LVDS124p,_DQ0R7/DQ1R16)* N24(IO,_LVDS126n)* T7(IO,_LVDS15p)* T10(IO,_LVDS23p)* U7(IO,_LVDS12n,_DQ3L3/DQ3L12)* U10(IO,_LVDS18n)* V3(IO,_LVDS14n) W4(IO,_LVDS11p,_(CDPCLK1/DQS3L)/(CDPCLK1/DQS3L))* Y3(IO,_LVDS8p)* Y4(IO,_LVDS8n)* Y22(IO,_LVDS148p)*

## Buses and harness runs
bus BUS_A[24..1]
bus BUS_D[31..0]
bus BUS_NBE[3..0]
bus DAU_TFT_BLUE[4..0]
bus DAU_TFT_CL[3..1]
bus DAU_TFT_GREEN[5..0]
bus DAU_TFT_RED[4..0]
bus DIP[7..0]
bus EXTEND_A[49..0]
bus EXTEND_B[49..0]
bus EXTEND_C[49..0]
bus FPGA_ID[3..0]
bus FPGA_M[2..0]
bus IO[35..0]
bus LED[7..0]
bus SRAM1_A[18..0]
bus SRAM1_D[15..0]
bus SRAM2_A[18..0]
bus SRAM2_D[15..0]
bus SW[4..0]

## Layout directives
net class FPGACONF: FPGA_CCLK, FPGA_DIN, FPGA_DONE, FPGA_INIT, FPGA_M0, FPGA_M1, FPGA_PROGRAM, FPGA_TCK, FPGA_TDI, FPGA_TDO, FPGA_TMS

## Notes on the sheet
- DAUGHTER BOARD I/O
- HOST PERIPHERALS
- DAUGHTER BOARD MEMORY RESOURCES
- TFT LCD DISPLAY INTERFACE
- ONE-WIRE CONNECTIONS
- JTAG
- PROGRAM
- SPI BUS
- CLOCKS
- FPGA_ID = 0x1 (Altera)
- Project Title
- Sheet Title
- Size:
- Date:
- File:
- A2
- Assy:
- Time:
- Revision:
- Sheet
- of
- (in symbol D-241-0004, part A) BANK 1
- (in symbol D-241-0004, part B) BANK 2
- (in symbol D-241-0004, part C) BANK 3
- (in symbol D-241-0004, part D) BANK 4
- (in symbol D-241-0004, part E) BANK 5
- (in symbol D-241-0004, part F) BANK 6
- (in symbol D-241-0004, part G) BANK 7
- (in symbol D-241-0004, part H) BANK 8

## Library data of the parts
NT2-NT6 NT8 = D-002-0002: Net-Tie, Surface Mount, 2 x 0.4mm x 0.2mm SMT Pads - For 0.2mm Track; Status: Production; Category: Net-Tie
R1-R4 R7 = D-100-0088: Resistor, 4K7 1% 0402 (1005); Power Rating: 63 mW; Resistance: 4.7 K; Mounting Technology: Surface Mount; Status: Production; Tolerance: 1 %; Category: Resistor
R8 R12 R14 R18 R20 R22-R27 = D-100-0131: Resistor, 100R 1% 0402 (1005); Power Rating: 63 mW; Mounting Technology: Surface Mount; Resistance: 100 R; Status: Production; Tolerance: 1 %; Category: Resistor
U1 = D-241-0004: FPGA, Altera Cyclone2-35 F672; Supply Voltage: mV; Mounting Technology: Surface Mount; Status: Production; Technology: None; Category: IC-FPGA